# Altium project FL-0004 Power Rail Probe.PrjPcb (part 1 of 3)
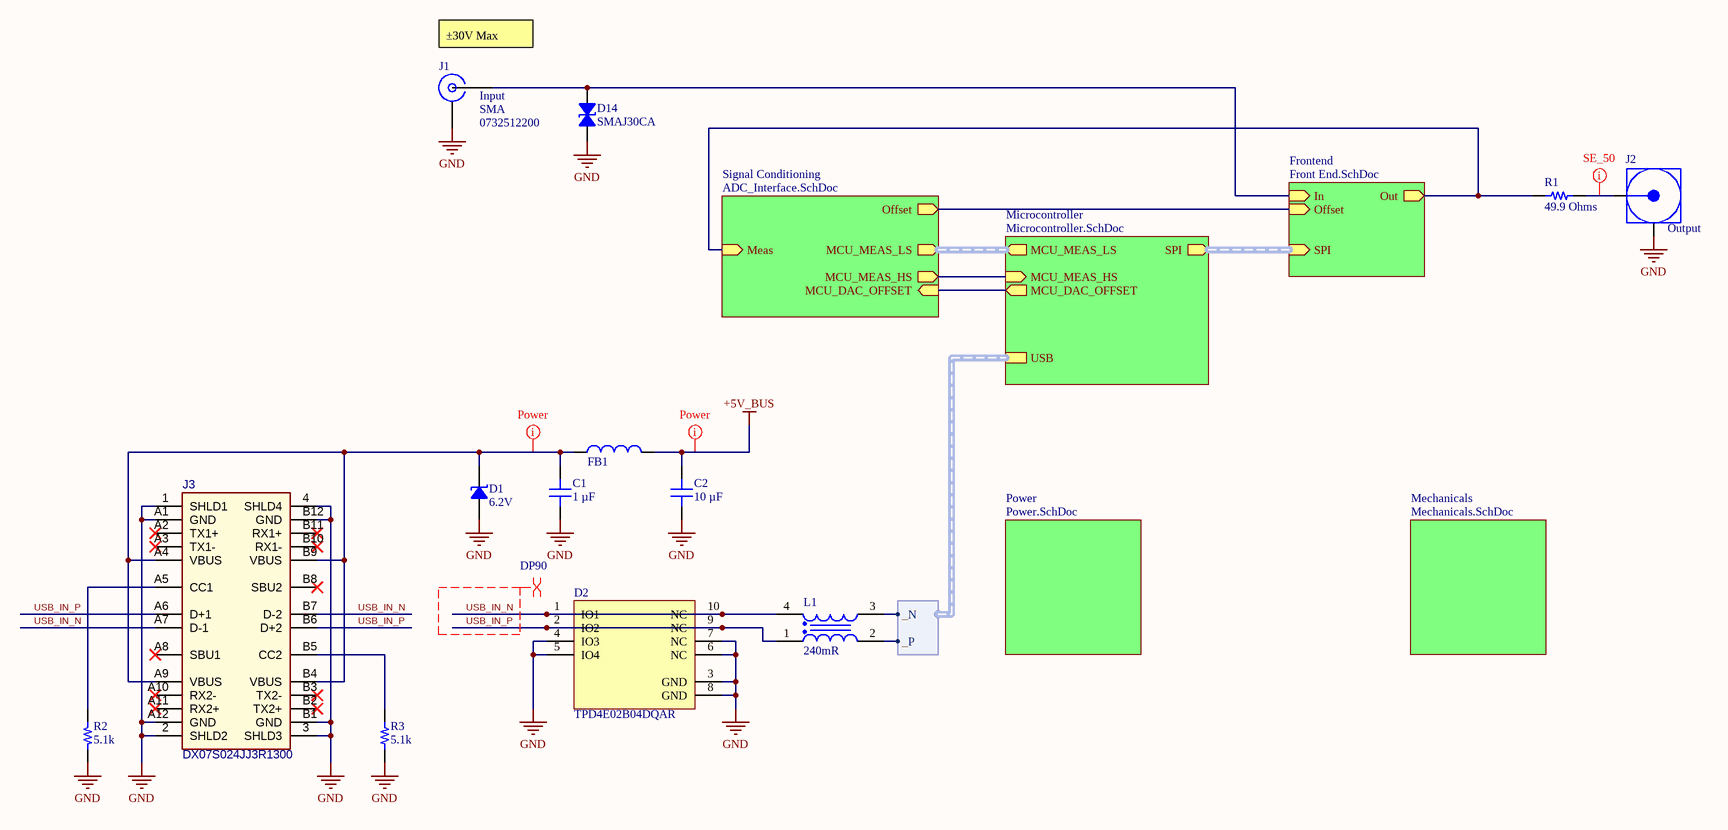
[diagram p0: Cover Sheet.SchDoc]
PRJ_Title: Power Rail Probe; PRJ_Number: FL-0004; PRJ_Engineer: Alexander Davis; PRJ_Customer: Public Release; PRJ_Copyright: ©2024 Flycatcher Labs - All Rights Reserved; PCB_Rev: A; Layout: Alex Davis; CurrentYear: 2024; BOM_Rev: 01; Address1: Flycatcher Labs
6 sheets, 200 parts. Net scope: hierarchical (ports join the sheet entries above them; power ports are global).
Board file: FL-0004.PCBDOC
Sheets:
  Cover Sheet.SchDoc
    Mechanicals = Mechanicals.SchDoc
    Frontend = Front End.SchDoc
    Microcontroller = Microcontroller.SchDoc
    Power = Power.SchDoc
    Signal Conditioning = ADC_Interface.SchDoc

## Sheet Cover Sheet.SchDoc: Cover Sheet
size Tabloid; SheetNumber: 1; SheetTotal: 6

### Parts
C1  1 µF  [CAP 0402_1005]
C2  10 µF  [CAP 0805_2012]
D1  Voltage - Breakdown (Min): 6.2V  [SOD323]  (hidden comment: D5V0S1U2WS-7)
D2  TPD4E02B04DQAR  [FP-DQA0010A-MFG]
D14  SMAJ30CA  [DO214AC SMA]
FB1  74279226101  [WE-MPSB_1812_L4.5W3.2H2.3]  (value not drawn)
J1  Input  Connector Style: SMA  Part Number: 0732512200  [MOLEX SD-73251-220 (NICKEL, 2.79MM FEET)]
J2  Output  [TE - 5227161-3]
J3  DX07S024JJ3R1300  [JAE-DX07S024JJ3_V]
L1  value 240mR  [WE-CNSW HF_0805]  (hidden comment: 744233670)
R1  49.9 Ohms  [RES 0805_2012]
R2  5.1k  [RES 0402_1005]
R3  5.1k  [RES 0402_1005]

### Sub-sheets
Frontend = Front End.SchDoc: SPI (in, harness SPI), Out (out), In (in), Offset (in)
Mechanicals = Mechanicals.SchDoc: no entries
Microcontroller = Microcontroller.SchDoc: SPI (out, harness SPI), MCU_DAC_OFFSET (out), MCU_MEAS_LS (out, harness DP), MCU_MEAS_HS (in), USB (harness DP)
Power = Power.SchDoc: no entries
Signal Conditioning = ADC_Interface.SchDoc: Meas (in), MCU_DAC_OFFSET (in), MCU_MEAS_LS (out, harness DP), MCU_MEAS_HS (out), Offset (out)

### Harnesses
DP: _P, _N

### Nets
+5V_BUS: C2.2 FB1.1
GND: C1.1 C2.1 D1.1 D2.3(GND) D2.4(IO3) D2.5(IO4) D2.6(NC) D2.7(NC) D2.8(GND) D14.1 J1.G(GND) J2.G(GND) J3.1(SHLD1) J3.2(SHLD2) J3.3(SHLD3) J3.4(SHLD4) J3.A1(GND) J3.A12(GND) J3.B1(GND) J3.B12(GND) R2.1 R3.1
MCU_DAC_Offset: sheet Microcontroller/MCU_DAC_OFFSET, sheet Signal Conditioning/MCU_DAC_OFFSET
MCU_MEAS_HS: sheet Microcontroller/MCU_MEAS_HS, sheet Signal Conditioning/MCU_MEAS_HS
MEAS_IN: D14.2 J1.S(SIGNAL) ; sheet Frontend/In
MEAS_OUT: R1.1 ; sheet Frontend/Out, sheet Signal Conditioning/Meas
OFFSET: sheet Frontend/Offset, sheet Signal Conditioning/Offset
USB._N: L1.3 ; sheet Microcontroller/USB._N
USB._P: L1.2 ; sheet Microcontroller/USB._P
USB_IN_N: D2.1(IO1) D2.10(NC) J3.A7(D-1) J3.B7(D-2) L1.4
USB_IN_P: D2.2(IO2) D2.9(NC) J3.A6(D+1) J3.B6(D+2) L1.1
NetC1_2: C1.2 D1.2 FB1.2 J3.A4(VBUS) J3.A9(VBUS) J3.B4(VBUS) J3.B9(VBUS)
NetJ2_S: J2.S(Signal) R1.2
NetJ3_A5: J3.A5(CC1) R2.2
NetJ3_B5: J3.B5(CC2) R3.2

Not connected (* = marked no-connect by the designer): J3 A2(TX1+)* A3(TX1-)* A8(SBU1)* A10(RX2-)* A11(RX2+)* B2(TX2+)* B3(TX2-)* B8(SBU2)* B10(RX1-)* B11(RX1+)*

### Buses and harness runs
harness sheet Frontend/SPI = sheet Microcontroller/SPI
harness sheet Microcontroller/MCU_MEAS_LS = sheet Signal Conditioning/MCU_MEAS_LS

### Layout directives
net class Power: +5V_BUS, NetC1_2
differential pair; differential pair class DP90: USB_IN_N, USB_IN_P
net class SE_50: NetJ2_S

### Notes on the sheet
- (near J1) ±30V Max

### Library data of the parts
C1 = CL05A105KO5NNNC: CAP CER 1UF 16V X5R 0402; manufacturer: Samsung Electro-Mechanics; Tolerance: ±10%; Part Number: CL05A105KO5NNNC; Value: 1 µF; Applications: General Purpose; Capacitance: 1 µF; componentlink1description: Datasheet; componentlink1url: http://www.samsungsem.com/kr/support/product-search/mlcc/CL05A105KO5NNNC.jsp; componentlink2description: DigiKey Link; componentlink2url: https://www.digikey.com/en/products/detail/samsung-electro-mechanics/CL05A105KO5NNNC/3886725; Device Package: 0402 (1005 Metric); lastupdated: 2/9/2024 8:04:35 PM; Lifecycle Status: Active; Minimum Order: 1; Mounting Type: Surface Mount, MLCC; Operating Temperature: -55°C ~ 85°C; Package / Case: 0402 (1005 Metric); packaging: TapeAndReel; partid: 3120; Part Status: Active; price: 0.01; series: CL; Size / Dimension: 0.039" L x 0.020" W (1.00mm x 0.50mm); Supplier 1: DigiKey; Supplier Part Number 1: 1276-1067-1-ND; Temperature Coefficient: X5R; Thickness (Max): 0.022" (0.55mm); Voltage - Rated: 16V
C2 = GCM21BC71E106KE36L: CAP CER 10UF 25V X7S 0805; manufacturer: Murata Electronics; Tolerance: ±10%; Part Number: GCM21BC71E106KE36L; Value: 10 µF; Applications: Automotive; Capacitance: 10 µF; componentlink1description: Datasheet; componentlink1url: https://search.murata.co.jp/Ceramy/image/img/A01X/G101/ENG/GCM21BC71E106KE36-01A.pdf; componentlink2description: DigiKey Link; componentlink2url: https://www.digikey.com/en/products/detail/murata-electronics/GCM21BC71E106KE36L/16821116; Device Package: 0805 (2012 Metric); lastupdated: 2/9/2024 8:14:44 PM; Lifecycle Status: Active; Minimum Order: 1; Mounting Type: Surface Mount, MLCC; Operating Temperature: -55°C ~ 125°C; Package / Case: 0805 (2012 Metric); packaging: TapeAndReel; partid: 48794; Part Status: Active; price: 0.09; Ratings: AEC-Q200; series: GCM; Size / Dimension: 0.079" L x 0.049" W (2.00mm x 1.25mm); Supplier 1: DigiKey; Supplier Part Number 1: 490-GCM21BC71E106KE36LCT-ND; Temperature Coefficient: X7S; Thickness (Max): 0.057" (1.45mm); Voltage - Rated: 25V
D1 = D5V0S1U2WS-7: TVS DIODE 5.5V 16V SOD323; Manufacturer: Diodes Incorporated; Capacitance @ Frequency: 950pF @ 1MHz; Current - Peak Pulse (10/1000µs): 70A (8/20µs); Power Line Protection: No; Power - Peak Pulse: 1000W (1kW); Type: Zener; Unidirectional Channels: 1; Voltage - Reverse Standoff (Typ): 5.5V (Max); Part Number: D5V0S1U2WS-7; Applications: Automotive; ComponentLink1Description: Datasheet; ComponentLink1URL: https://www.diodes.com/assets/Datasheets/D5V0S1U2WS.pdf; ComponentLink2Description: DigiKey Link; ComponentLink2URL: http://digikey.com/product-detail/en/diodes-incorporated/D5V0S1U2WS-7/31-D5V0S1U2WS-7CT-ND/11643340; LastUpdated: 8/30/2020 9:07:50 PM; Lifecycle Status: Active; Minimum Order: 1; Mounting Type: Surface Mount; Package / Case: SC-76, SOD-323; Packaging: CutTape; PartId: 11491; Price: 0.37; Series: Automotive, AEC-Q101; Supplier 1: DigiKey; Supplier Part Number 1: 31-D5V0S1U2WS-7CT-ND; Supplier Device Package: SOD-323; Voltage - Clamping (Max) @ Ipp: 16V
D2 = CMP-004-00031-2: Quad 0.25-pF, ±3.6-V, ±12-kV ESD protection diode for USB 3.0, HDMI 2.0 & High Speed Signals; Interface: USB,HDMI; Number of Bidirectional Channels: 4; Min Breakdown Voltage: 5.5V; Power Line Protection: No; Peak Pulse Power: 17W; Diode Type: ZENER; Peak Pulse Current: 5A; Breakdown Voltage: 6.4V; Direction: Bidirectional; Operating Supply Voltage: 3.6V; RoHS Compliant: Yes; Reach SVHC Compliant: No; Pins: 10; Number of Channels: 4; ComponentLink1URL: https://www.ti.com/lit/ds/symlink/tpd4e02b04.pdf; Packaging: Cut Tape; Mounting Technology: Surface Mount; Max Operating Temperature: 125°C; Width: 1mm; Thickness: 500um; Length: 2.5mm; Lead Free: Lead Free; ComponentLink1Description: Datasheet; Min Operating Temperature: -40°C; Series: -; Reverse Standoff Voltage: 3.6V; Height: 550um
D14 = SMAJ30CA: TVS DIODE 30VWM 48.4VC DO214AC; Manufacturer: Littelfuse Inc.; Bidirectional Channels: 1; Current - Peak Pulse (10/1000µs): 8.3A; Power Line Protection: No; Power - Peak Pulse: 400W; Type: Zener; Voltage - Breakdown (Min): 33.3V; Voltage - Clamping (Max) @ Ipp: 48.4V; Voltage - Reverse Standoff (Typ): 30V; Part Number: SMAJ30CA; Applications: General Purpose; ComponentLink1Description: Datasheet; ComponentLink1URL: https://www.littelfuse.com/~/media/electronics/datasheets/tvs_diodes/littelfuse_tvs_diode_smaj_datasheet.pdf.pdf; ComponentLink2Description: DigiKey Link; ComponentLink2URL: https://www.digikey.com/en/products/detail/littelfuse-inc/SMAJ30CA/762295; LastUpdated: 6/3/2024 8:21:17 PM; Lifecycle Status: Active; Minimum Order: 1; Mounting Type: Surface Mount; Operating Temperature: -65°C ~ 150°C (TJ); Package / Case: DO-214AC, SMA; Packaging: TapeAndReel; PartId: 7378; Part Status: Active; Price: 0.08; Series: SMAJ; Supplier 1: DigiKey; Supplier Part Number 1: SMAJ30CALFCT-ND; Supplier Device Package: DO-214AC (SMA)
FB1 = CMP-000000-2: Ferrite Beads Multi-Layer Power 100Ohm 25% 100MHz 8A 0.006Ohm DCR 1812 Automotive T/R; Impedance: 100R; Number of Lines: 1; Termination: SMD/SMT; Width: 3.2mm; Max Current Rating: 8A; Max DC Current: 8A; Package Quantity: 2500; ComponentLink1URL: https://www.we-online.com/components/products/datasheet/74279226101.pdf; Packaging: Cut Tape; Mounting Technology: Surface Mount; Max Operating Temperature: 125°C; Case/Package: 1812; Case Code (Imperial): 1812; RoHS Compliant: Yes; Test Frequency: 100MHz; Min Operating Temperature: -55°C; Lead Free: Lead Free; Tolerance: 25%; ComponentLink1Description: Datasheet; Series: WE-MPSB; Weight: 0.000952oz; Length: 4.5mm; Case Code (Metric): 4532; Height: 2.3mm
J1 = 0732512200: CONN SMA JACK R/A 50 OHM PCB; Manufacturer: Molex; Connector Type: Jack, Female Socket; Contact Termination: Solder; Frequency - Max: 18GHz; Impedance: 50Ohm; Number of Ports: 1; ComponentLink1Description: Datasheet; ComponentLink1URL: https://www.molex.com/pdm_docs/ps/PS-89675-346.pdf; ComponentLink2Description: DigiKey Link; ComponentLink2URL: http://digikey.com/product-detail/en/molex/0732512200/WM9352-ND/3468838; Fastening Type: Threaded; Housing Color: Silver; LastUpdated: 6/29/2022 6:13:17 PM; Lifecycle Status: Active; Minimum Order: 1; Mounting Feature: Bulkhead - Front Side Nut; Mounting Type: Panel Mount, Through Hole, Right Angle; Packaging: Bulk; Part Status: Active; Price: 5.75; Series: 73251; Shield Termination: Solder; Supplier 1: DigiKey; Supplier Part Number 1: WM9352-ND
J2 = CMP-002-00083-2: RF BNC Connector, 1 Contact(s), Female, Panel Mount, Solder Terminal, Locking, Jack; pin to pad: G>2 S>1; Sealable: No (Without); Number of Positions: 1; Voltage Rating: 500V; PCB Mounting Orientation: Right Angle; Operating Frequency: 0 to 4 GHz; Insulation Resistance: 5GR; Frequency: 4GHz; Body Material: Zinc; Dielectric Material: Polymethylpentene; PCB Mount Retention: With; Body Plating: Nickel; Impedance: 50R; Connector Type: BNC,Jack; Polarity: Standard,Normal; Packaging: Rail/Tube; Reach SVHC Compliant: No; Height: 15.88mm; Min Operating Temperature: -55°C; Mounting Technology: Panel; Orientation: Right Angle; Gender: Female; Fastening Type: Bayonet; ComponentLink1URL: https://www.te.com/commerce/DocumentDelivery/DDEController?Action=showdoc&DocId=Customer+Drawing%7F5227161%7FB4%7Fpdf%7FEnglish%7FENG_CD_5227161_B4.pdf%7F5227161-3; Radiation Hardening: No; Termination: Through Hole; Length: 14.76mm; Contact Plating: Gold; Package Quantity: 35; ComponentLink1Description: Datasheet; Max Operating Temperature: 85°C; Color: White; Housing Color: White; Insulation Material: Polymethylpentene; Contact Material: Bronze; Series: BNC; Clock Frequency: 4GHz; Depth: 14.76mm
J3 = CMP-002-00065-3: USB-C Connector, 20 V, 1.25 A, -30 to 80 degC, RoHS, Tape and Reel; Gender: Receptacle; Pins: 28; Connector Type: USB-C
L1 = CMP-006-00022-3: WE-CNSW HF SMT Common Mode Line Filter (High Frequ; Impedance: 67R; Current: 320mA; Number of Lines: 2; Operating Frequency: 10  1000MHz; Tolerance: 25%; Voltage Rating (AC): 50V; Test Frequency: 100MHz; Frequency: 6.5GHz; Lead Free: Lead Free; Packaging: Tape and Reel; RoHS Compliant: Yes; Max Operating Temperature: 105°C; Mounting Technology: Surface Mount; Width: 0.85mm; ComponentLink1Description: Datasheet; Reach SVHC Compliant: No; Case/Package: 0805; Max DC Current: 320mA; Pins: 4; Voltage Rating: 50V; ComponentLink1URL: https://www.we-online.com/components/products/datasheet/744233670.pdf; Min Operating Temperature: -40°C; Current Rating: 320mA; Depth: 1.2mm; DC Resistance (DCR): 240mR; Termination: SMD/SMT; Package Quantity: 1; Voltage Rating (DC): 50V; Length: 0.079inch; Max Current Rating: 320mA; Series: WE-CNSW; Height: 0.055inch
R1 = CRCW080549R9FKEAHP: RES SMD 49.9 OHM 1% 1/2W 0805; Manufacturer: Vishay Dale; Power (Watts): 0.5W, 1/2W; Temperature Coefficient: ±100ppm/°C; Part Number: CRCW080549R9FKEAHP; Value: 49.9 Ohms; ComponentLink1Description: Datasheet; ComponentLink1URL: http://www.vishay.com/docs/20043/crcwhpe3.pdf; ComponentLink2Description: DigiKey Link; ComponentLink2URL: https://www.digikey.com/en/products/detail/vishay-dale/CRCW080549R9FKEAHP/2222324; Composition: Thick Film; Device Package: 0805 (2012 Metric); Features: Automotive AEC-Q200, Pulse Withstanding; Height - Seated (Max): 0.020" (0.50mm); LastUpdated: 2/8/2024 9:02:28 PM; Lifecycle Status: Active; Minimum Order: 1; Number of Terminations: 2; Operating Temperature: -55°C ~ 155°C; Package / Case: 0805 (2012 Metric); Packaging: TapeAndReel; PartId: 30317; Part Status: Active; Price: 0.02; Ratings: AEC-Q200; Resistance: 49.9 Ohms; Series: CRCW-HP; Size / Dimension: 0.079" L x 0.049" W (2.00mm x 1.25mm); Supplier 1: DigiKey; Supplier Part Number 1: 541-49.9TCT-ND; Supplier Device Package: 0805; Tolerance: ±1%
R2 R3 = CRCW04025K10FKEDC: RES 5.1K OHM 1% 1/16W 0402; Manufacturer: Vishay Dale; Value: 5.1 kOhms; Power (Watts): 0.063W, 1/16W; Temperature Coefficient: ±100ppm/°C; Part Number: CRCW04025K10FKEDC; ComponentLink1Description: Datasheet; ComponentLink1URL: http://www.vishay.com/docs/28773/crcwce3.pdf; ComponentLink2Description: DigiKey Link; ComponentLink2URL: https://www.digikey.com/en/products/detail/vishay-dale/CRCW04025K10FKEDC/7928491; Composition: Thick Film; Device Package: 0402 (1005 Metric); Height - Seated (Max): 0.014" (0.35mm); LastUpdated: 2/9/2024 8:29:38 PM; Lifecycle Status: Active; Minimum Order: 1; Number of Terminations: 2; Operating Temperature: -55°C ~ 155°C; Package / Case: 0402 (1005 Metric); Packaging: CutTape; PartId: 16137; Part Status: Active; Price: 0.01; Resistance: 5.1 kOhms; Series: CRCW-C; Size / Dimension: 0.039" L x 0.020" W (1.00mm x 0.50mm); Supplier 1: DigiKey; Supplier Part Number 1: 541-4069-1-ND; Supplier Device Package: 0402; Tolerance: ±1%

## Sheet Mechanicals.SchDoc: Mechanicals
size Tabloid; SheetNumber: 6; SheetTotal: 6
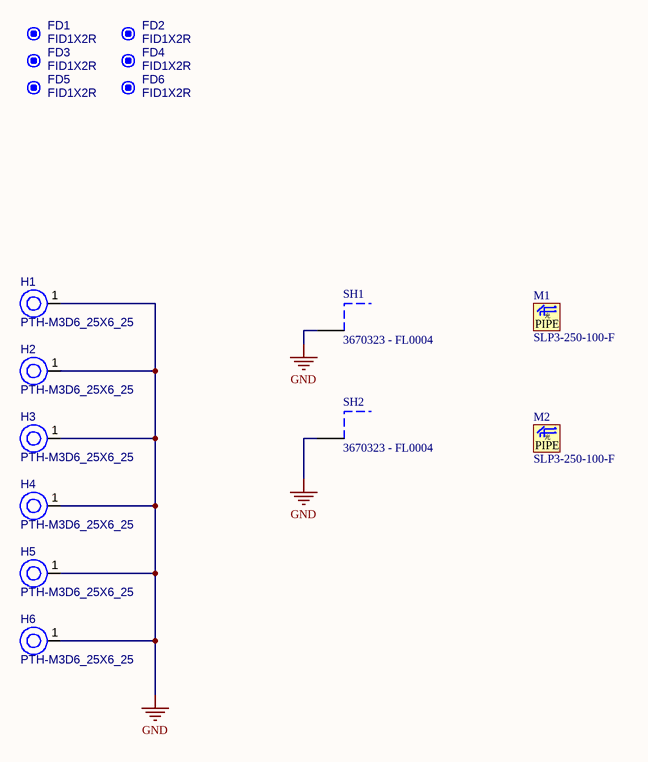
[diagram p1: Mechanicals.SchDoc]

### Parts
FD1  FID1X2R  [FID1X2R]  (no BOM)
FD2  FID1X2R  [FID1X2R]  (no BOM)
FD3  FID1X2R  [FID1X2R]  (no BOM)
FD4  FID1X2R  [FID1X2R]  (no BOM)
FD5  FID1X2R  [FID1X2R]  (no BOM)
FD6  FID1X2R  [FID1X2R]  (no BOM)
H1  PTH-M3D6_25X6_25  [PTH-M3D6_25X6_25]  (no BOM)
H2  PTH-M3D6_25X6_25  [PTH-M3D6_25X6_25]  (no BOM)
H3  PTH-M3D6_25X6_25  [PTH-M3D6_25X6_25]  (no BOM)
H4  PTH-M3D6_25X6_25  [PTH-M3D6_25X6_25]  (no BOM)
H5  PTH-M3D6_25X6_25  [PTH-M3D6_25X6_25]  (no BOM)
H6  PTH-M3D6_25X6_25  [PTH-M3D6_25X6_25]  (no BOM)
M1  SLP3-250-100-F  [BIVAR SLP3-250-100-F]
M2  SLP3-250-100-F  [BIVAR SLP3-250-100-F]
SH1  3670323 - FL0004  [3670323 - FL-0004]
SH2  3670323 - FL0004  [3670323 - FL-0004]

### Nets
GND: H1.1(H1) H2.1(H1) H3.1(H1) H4.1(H1) H5.1(H1) H6.1(H1) SH1.1 SH2.1

### Notes on the sheet
- (in symbol SLP3-250-100-F) 光; PIPE

### Library data of the parts
FD1-FD6 = CMP-00028-00005-3: Fiducial - Round 1x2mm; Pins: 0
H1-H6 = CMP-00028-00007-2: M3 PTH (3mm), 6.25mm pad; Pins: 1
M1 M2 = SLP3-250-100-F: LIGHT PIPE CLEAR 3MM LENS R/A; Manufacturer: Bivar Inc.; Configuration: Single; Lens Style: Round with Flat Top; Part Number: SLP3-250-100-F; Color: Clear; ComponentLink1Description: Datasheet; ComponentLink1URL: https://www.bivar.com/Files/Datasheets/SLP3-XXX-XXX-X.pdf; ComponentLink2Description: DigiKey Link; ComponentLink2URL: http://digikey.com/product-detail/en/bivar-inc/SLP3-250-100-F/492-1311-ND/2407221; LastUpdated: 3/20/2020 5:05:34 AM; Lens Size: 3mm; Lifecycle Status: Active; Minimum Order: 1; Mounting Type: Board Mount, Press Fit, Right Angle; Packaging: Unknown; Part Status: Active; Price: 0.59; Series: SLP-3; Supplier 1: DigiKey; Supplier Part Number 1: 492-1311-ND; Type: Rigid
SH1 SH2 = CMP-00025-00005-3: Shield Cabinet Frame, 32.3mm X 23.8mm Wurth Elektronik 3670323 - modified footprint for FL-0004

## Sheet Front End.SchDoc: Front End
size Tabloid; Organization: Davis Designs; Address1: Flycatcher Labs; SheetNumber: 2; SheetTotal: 6
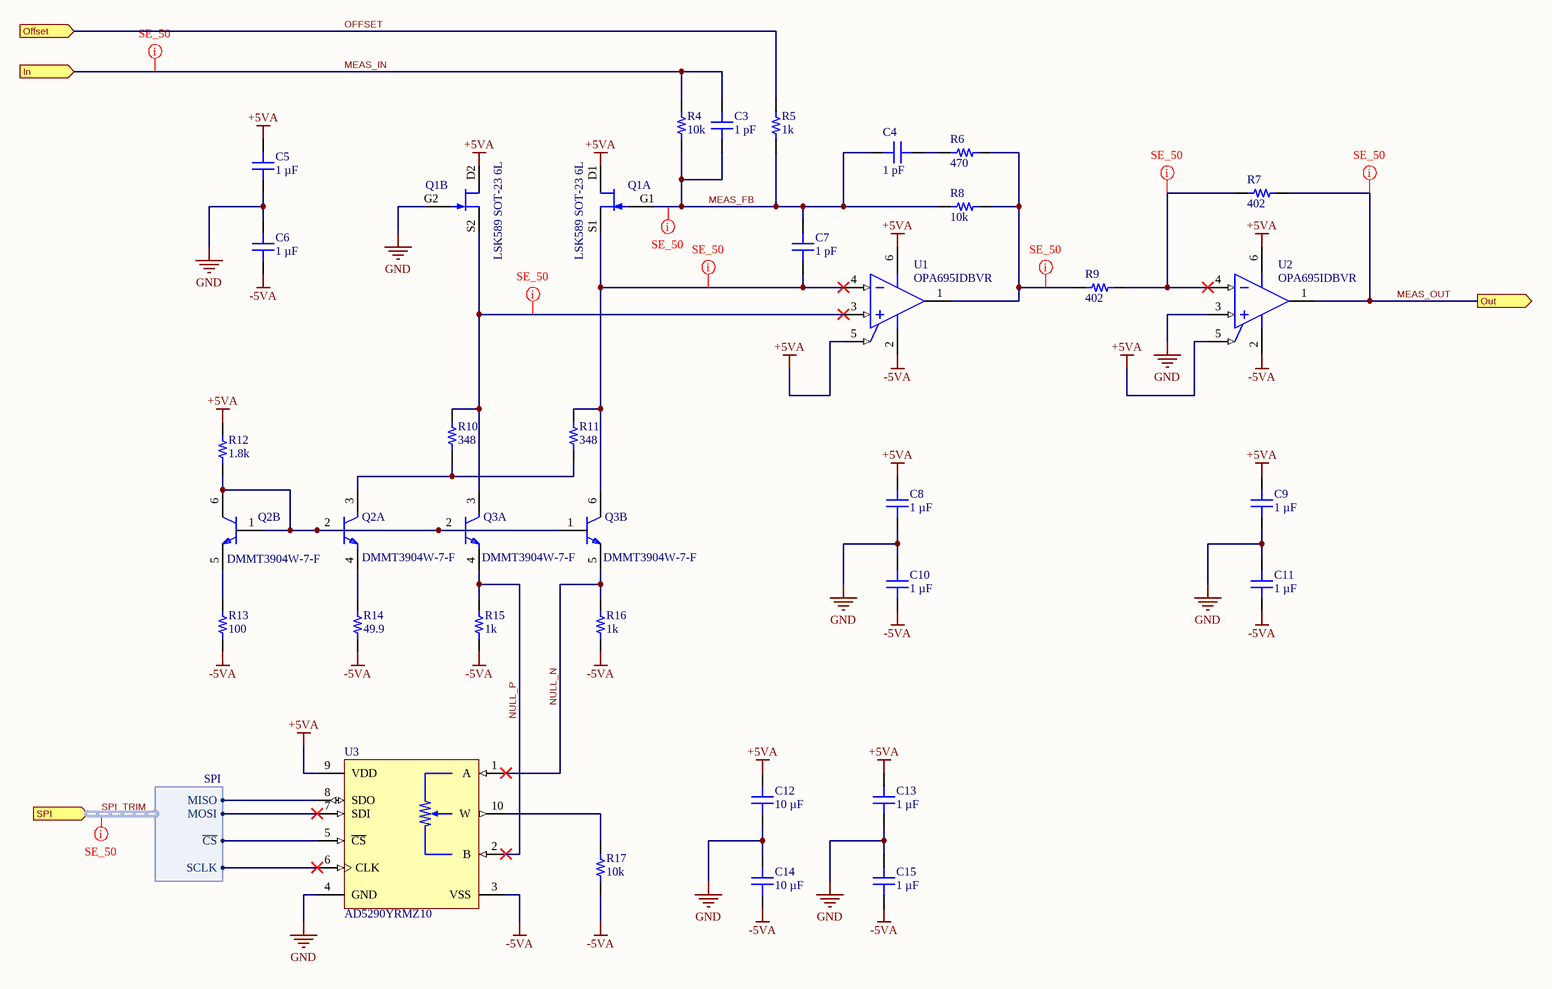
[diagram p2: Front End.SchDoc]

### Parts
C3  1 pF  [MURATA GCM155 0402_1005]
C4  1 pF  [MURATA GCM155 0402_1005]
C5  1 µF  [MURATA GRM155 0402_1005]
C6  1 µF  [MURATA GRM155 0402_1005]
C7  1 pF  [MURATA GCM155 0402_1005]
C8  1 µF  [MURATA GRM155 0402_1005]
C9  1 µF  [MURATA GRM155 0402_1005]
C10  1 µF  [MURATA GRM155 0402_1005]
C11  1 µF  [MURATA GRM155 0402_1005]
C12  10 µF  [CAP 0805_2012]
C13  1 µF  [MURATA GRM155 0402_1005]
C14  10 µF  [CAP 0805_2012]
C15  1 µF  [MURATA GRM155 0402_1005]
Q1  LSK589 SOT-23 6L  [SOT95P280X145-6N]  (parts A,B of 2)
Q2  DMMT3904W-7-F  [FP-SOT363-MFG]  (parts A,B of 2)
Q3  DMMT3904W-7-F  [FP-SOT363-MFG]  (parts A,B of 2)
R4  10k  [RES 0402_1005]
R5  1k  [RES 0402_1005]
R6  470  [RES 0402_1005]
R7  402  [RES 0402_1005]
R8  10k  [RES 0402_1005]
R9  402  [RES 0402_1005]
R10  348  [RES 0402_1005]
R11  348  [RES 0402_1005]
R12  1.8k  [RES 0402_1005]
R13  100  [RES 0402_1005]
R14  49.9  [RES 0402_1005]
R15  1k  [RES 0402_1005]
R16  1k  [RES 0402_1005]
R17  10k  [RES 0402_1005]
U1  OPA695IDBVR  [DBV0006A_M]
U2  OPA695IDBVR  [DBV0006A_M]
U3  AD5290YRMZ10  [FP-RM-10-IPC_B]

### Ports
In (in), Offset (in), Out (out), SPI (in, harness SPI)

### Harnesses
SPI: MOSI, MISO, ~{CS}, SCLK

### Nets
+5VA: C5.2 C8.2 C9.2 C12.2 C13.2 Q1.D1 Q1.D2 R12.2 U1.5(~{DIS}) U1.6(VS+) U2.5(~{DIS}) U2.6(VS+) U3.9(VDD)
-5VA: C6.1 C10.1 C11.1 C14.1 C15.1 R13.1 R14.1 R15.1 R16.1 R17.1 U1.2(VS-) U2.2(VS-) U3.3(VSS)
GND: C5.1 C6.2 C8.1 C9.1 C10.2 C11.2 C12.1 C13.1 C14.2 C15.2 Q1.G2 U2.3(IN+) U3.4(GND)
MEAS_FB: C3.1 C4.2 C7.2 Q1.G1 R4.1 R5.2 R8.2
MEAS_IN: C3.2 R4.2 ; port In
MEAS_OUT: R7.2 U2.1(OUT) ; port Out
NULL_N: Q3.5(E2) R16.2 U3.1(A)
NULL_P: Q3.4(E1) R15.2 U3.2(B)
OFFSET: R5.1 ; port Offset
SPI_TRIM~{.}CS: U3.5(~{CS}) ; port SPI.~{CS}
SPI_TRIM.MISO: U3.8(SDO) ; port SPI.MISO
SPI_TRIM.MOSI: U3.7(SDI) ; port SPI.MOSI
SPI_TRIM.SCLK: U3.6(CLK) ; port SPI.SCLK
NetC4_1: C4.1 R6.1
NetC7_1: C7.1 Q1.S1 Q3.6(C2) R11.2 U1.4(IN-)
NetQ1_S2: Q1.S2 Q3.3(C1) R10.2 U1.3(IN+)
NetQ2_1: Q2.1(B2) Q2.2(B1) Q2.6(C2) Q3.1(B2) Q3.2(B1) R12.1
NetQ2_3: Q2.3(C1) R10.1 R11.1
NetQ2_4: Q2.4(E1) R14.2
NetQ2_5: Q2.5(E2) R13.2
NetR6_2: R6.2 R8.1 R9.1 U1.1(OUT)
NetR7_1: R7.1 R9.2 U2.4(IN-)
NetR17_2: R17.2 U3.10(W)

### Buses and harness runs
harness SPI_TRIM = port SPI

### Layout directives
net class SE_50: (no net found under the mark), MEAS_FB, MEAS_IN, MEAS_OUT, NetC7_1, NetQ1_S2, NetR6_2, NetR7_1

### Library data of the parts
C3 C4 C7 = GCM1555C1H1R0BA16D: CAP CER 1PF 50V C0G/NP0 0402; manufacturer: Murata Electronics; Temperature Coefficient: C0G, NP0; Tolerance: ±0.1pF; Part Number: GCM1555C1H1R0BA16D; Value: 1 pF; Applications: Automotive; Capacitance: 1 pF; componentlink1description: Datasheet; componentlink1url: https://search.murata.co.jp/Ceramy/image/img/A01X/G101/ENG/GCM1555C1H1R0BA16-01.pdf; componentlink2description: DigiKey Link; componentlink2url: https://www.digikey.com/en/products/detail/murata-electronics/GCM1555C1H1R0BA16D/7363198; Device Package: 0402 (1005 Metric); lastupdated: 7/20/2024 2:04:19 AM; Lifecycle Status: Active; Minimum Order: 1; Mounting Type: Surface Mount, MLCC; Operating Temperature: -55°C ~ 125°C; Package / Case: 0402 (1005 Metric); packaging: TapeAndReel; partid: 2073; Part Status: Active; price: 0.01; Ratings: AEC-Q200; series: GCM; Size / Dimension: 0.039" L x 0.020" W (1.00mm x 0.50mm); Supplier 1: DigiKey; Supplier Part Number 1: 490-16454-1-ND; Thickness (Max): 0.022" (0.55mm); Voltage - Rated: 50V
C5 C6 C8-C11 C13 C15 = GRM155R61E105MA12D: CAP CER 1UF 25V X5R 0402; manufacturer: Murata Electronics; Tolerance: ±20%; Part Number: GRM155R61E105MA12D; Value: 1 µF; Applications: General Purpose; Capacitance: 1 µF; componentlink1description: Datasheet; componentlink1url: https://search.murata.co.jp/Ceramy/image/img/A01X/G101/ENG/GRM155R61E105MA12-01.pdf; componentlink2description: DigiKey Link; componentlink2url: https://www.digikey.com/en/products/detail/murata-electronics/GRM155R61E105MA12D/4905141; Device Package: 0402 (1005 Metric); lastupdated: 7/25/2024 4:50:24 AM; Lifecycle Status: Active; Minimum Order: 1; Mounting Type: Surface Mount, MLCC; Operating Temperature: -55°C ~ 85°C; Package / Case: 0402 (1005 Metric); packaging: TapeAndReel; partid: 3014; Part Status: Active; price: 0.01; series: GRM; Size / Dimension: 0.039" L x 0.020" W (1.00mm x 0.50mm); Supplier 1: DigiKey; Supplier Part Number 1: 490-10018-1-ND; Temperature Coefficient: X5R; Thickness (Max): 0.022" (0.55mm); Voltage - Rated: 25V
C12 C14 = GCM21BC71E106KE36L: as C2 on sheet Cover Sheet; Part Number: GCM21BC71E106KE36L; Value: 10 µF; Applications: Automotive; Capacitance: 10 µF; componentlink1description: Datasheet; componentlink1url: https://search.murata.co.jp/Ceramy/image/img/A01X/G101/ENG/GCM21BC71E106KE36-01A.pdf; componentlink2description: DigiKey Link; componentlink2url: https://www.digikey.com/en/products/detail/murata-electronics/GCM21BC71E106KE36L/16821116; Device Package: 0805 (2012 Metric); lastupdated: 2/9/2024 8:14:44 PM; Lifecycle Status: Active; Minimum Order: 1; Mounting Type: Surface Mount, MLCC; Operating Temperature: -55°C ~ 125°C; Package / Case: 0805 (2012 Metric); packaging: TapeAndReel; partid: 48794; Part Status: Active; price: 0.09; Ratings: AEC-Q200; series: GCM; Size / Dimension: 0.079" L x 0.049" W (2.00mm x 1.25mm); Supplier 1: DigiKey; Supplier Part Number 1: 490-GCM21BC71E106KE36LCT-ND; Temperature Coefficient: X7S; Thickness (Max): 0.057" (1.45mm); Voltage - Rated: 25V
Q1 = CMP-013-00039-2: Low Noise, Monolithic Dual, N-Channel JFET; pin to pad: D1>2 D2>5 G1>1 G2>4 S1>3 S2>6; Temperature (min): -55; Vgs Off: 1.5V; Vgs Max: 25V; Input Capacitance: 5pF; Temperature (max): 150; Ids Max: 7mA; Transistor Type: JFET N-Channel Dual; ComponentLink1URL: https://www.linearsystems.com/_files/ugd/7e8069_bae9694bd1b545959f18563741a7b804.pdf; Package: SOT-23-6; ComponentLink1Description: Datasheet
Q2 Q3 = CMP-013-00040-2: TRANS 2NPN 40V 0.2A SOT363; Polarity: NPN; Emitter Base Voltage (VEBO): 6V; Continuous Collector Current: 200mA; Collector-emitter Voltage-Max: 300mV; Frequency: 300MHz; Collector Base Voltage (VCBO): 60V; hFE Min: 100; Max Power Dissipation: 200mW; Number of Elements: 2; Width: 1.35mm; Voltage Rating (DC): 40V; Height: 1mm; Case/Package: SOT-363; Length: 2.2mm; Max Operating Temperature: 150°C; Max Breakdown Voltage: 40V; Collector Emitter Voltage (VCEO): 40V; Lead Free: Lead Free; Current Rating: 200mA; Weight: 0.000212oz; Clock Frequency: 300MHz; Reach SVHC Compliant: Yes; Package Quantity: 3000; Packaging: Tape and Reel; Collector Emitter Breakdown Voltage: 40V; Transition Frequency: 300MHz; Min Operating Temperature: -55°C; Mounting Technology: Surface Mount; Radiation Hardening: No; Series: -; Max Collector Current: 200mA; Gain Bandwidth Product: 300MHz; Pins: 6; Power Dissipation: 200mW; Collector Emitter Saturation Voltage: 300mV; ComponentLink1Description: Datasheet; ComponentLink1URL: https://www.diodes.com/assets/Datasheets/DMMT3904W.pdf
R4 R8 R17 = ERA-2VRW1002X: RES 10K OHM 0.05% 1/10W 0402; Manufacturer: Panasonic Electronic Components; Value: 10 kOhms; Power (Watts): 0.1W, 1/10W; Temperature Coefficient: ±10ppm/°C; Part Number: ERA-2VRW1002X; ComponentLink1Description: Datasheet; ComponentLink1URL: https://api.pim.na.industrial.panasonic.com/file_stream/main/fileversion/9152; ComponentLink2Description: DigiKey Link; ComponentLink2URL: https://www.digikey.com/en/products/detail/panasonic-electronic-components/ERA-2VRW1002X/12085128; Composition: Thin Film; Device Package: 0402 (1005 Metric); Height - Seated (Max): 0.016" (0.40mm); LastUpdated: 2/9/2024 8:28:44 PM; Lifecycle Status: Active; Minimum Order: 1; Number of Terminations: 2; Operating Temperature: -55°C ~ 155°C; Package / Case: 0402 (1005 Metric); Packaging: TapeAndReel; PartId: 70282; Part Status: Active; Price: 0.21; Resistance: 10 kOhms; Series: ERA-2V; Size / Dimension: 0.039" L x 0.020" W (1.00mm x 0.50mm); Supplier 1: DigiKey; Supplier Part Number 1: 10-ERA-2VRW1002XCT-ND; Supplier Device Package: 0402; Tolerance: ±0.05%; Features: Anti-Sulfur, Automotive AEC-Q200; Ratings: AEC-Q200
R5 R15 R16 = ERA-2AEB102X: RES SMD 1K OHM 0.1% 1/16W 0402; Manufacturer: Panasonic Electronic Components; Value: 1 kOhms; Power (Watts): 0.063W, 1/16W; Temperature Coefficient: ±25ppm/°C; Part Number: ERA-2AEB102X; ComponentLink1Description: Datasheet; ComponentLink1URL: https://industrial.panasonic.com/cdbs/www-data/pdf/RDM0000/AOA0000C307.pdf; ComponentLink2Description: DigiKey Link; ComponentLink2URL: https://www.digikey.com/en/products/detail/panasonic-electronic-components/ERA-2AEB102X/1706005; Composition: Thin Film; Device Package: 0402 (1005 Metric); Features: Automotive AEC-Q200; Height - Seated (Max): 0.016" (0.40mm); LastUpdated: 2/9/2024 8:30:08 PM; Lifecycle Status: Active; Minimum Order: 1; Number of Terminations: 2; Operating Temperature: -55°C ~ 155°C; Package / Case: 0402 (1005 Metric); Packaging: TapeAndReel; PartId: 6077; Part Status: Active; Price: 0.04; Ratings: AEC-Q200; Resistance: 1 kOhms; Series: ERA-2A; Size / Dimension: 0.039" L x 0.020" W (1.00mm x 0.50mm); Supplier 1: DigiKey; Supplier Part Number 1: P1.0KDCCT-ND; Supplier Device Package: 0402; Tolerance: ±0.1%
R6 = CRCW0402470RFKEDC: RES 470 OHM 1% 1/16W 0402; Manufacturer: Vishay Dale; Value: 470 Ohms; Power (Watts): 0.063W, 1/16W; Temperature Coefficient: ±100ppm/°C; Part Number: CRCW0402470RFKEDC; ComponentLink1Description: Datasheet; ComponentLink1URL: http://www.vishay.com/docs/28773/crcwce3.pdf; ComponentLink2Description: DigiKey Link; ComponentLink2URL: https://www.digikey.com/en/products/detail/vishay-dale/CRCW0402470RFKEDC/7928494; Composition: Thick Film; Device Package: 0402 (1005 Metric); Height - Seated (Max): 0.014" (0.35mm); LastUpdated: 2/9/2024 8:29:48 PM; Lifecycle Status: Active; Minimum Order: 1; Number of Terminations: 2; Operating Temperature: -55°C ~ 155°C; Package / Case: 0402 (1005 Metric); Packaging: CutTape; PartId: 12711; Part Status: Active; Price: 0.01; Resistance: 470 Ohms; Series: CRCW-C; Size / Dimension: 0.039" L x 0.020" W (1.00mm x 0.50mm); Supplier 1: DigiKey; Supplier Part Number 1: 541-4072-1-ND; Supplier Device Package: 0402; Tolerance: ±1%
R7 R9 = ERA-2AEB4020X: RES SMD 402 OHM 0.1% 1/16W 0402; Manufacturer: Panasonic Electronic Components; Value: 402 Ohms; Power (Watts): 0.063W, 1/16W; Temperature Coefficient: ±25ppm/°C; Part Number: ERA-2AEB4020X; ComponentLink1Description: Datasheet; ComponentLink1URL: https://industrial.panasonic.com/cdbs/www-data/pdf/RDM0000/AOA0000C307.pdf; ComponentLink2Description: DigiKey Link; ComponentLink2URL: https://www.digikey.com/en/products/detail/panasonic-electronic-components/ERA-2AEB4020X/2026017; Composition: Thin Film; Device Package: 0402 (1005 Metric); Features: Automotive AEC-Q200; Height - Seated (Max): 0.016" (0.40mm); LastUpdated: 2/9/2024 8:29:56 PM; Lifecycle Status: Active; Minimum Order: 1; Number of Terminations: 2; Operating Temperature: -55°C ~ 155°C; Package / Case: 0402 (1005 Metric); Packaging: TapeAndReel; PartId: 9913; Part Status: Active; Price: 0.04; Ratings: AEC-Q200; Resistance: 402 Ohms; Series: ERA-2A; Size / Dimension: 0.039" L x 0.020" W (1.00mm x 0.50mm); Supplier 1: DigiKey; Supplier Part Number 1: P402DCCT-ND; Supplier Device Package: 0402; Tolerance: ±0.1%
R10 R11 = CRCW0402348RFKED: RES SMD 348 OHM 1% 1/16W 0402; Manufacturer: Vishay Dale; Value: 348 Ohms; Power (Watts): 0.063W, 1/16W; Temperature Coefficient: ±100ppm/°C; Part Number: CRCW0402348RFKED; ComponentLink1Description: Datasheet; ComponentLink1URL: http://www.vishay.com/docs/20035/dcrcwe3.pdf; ComponentLink2Description: DigiKey Link; ComponentLink2URL: https://www.digikey.com/en/products/detail/vishay-dale/CRCW0402348RFKED/1177953; Composition: Thick Film; Device Package: 0402 (1005 Metric); Features: Automotive AEC-Q200; Height - Seated (Max): 0.016" (0.40mm); LastUpdated: 2/9/2024 8:29:58 PM; Lifecycle Status: Active; Minimum Order: 1; Number of Terminations: 2; Operating Temperature: -55°C ~ 155°C; Package / Case: 0402 (1005 Metric); Packaging: TapeAndReel; PartId: 9380; Part Status: Active; Price: 0.01; Ratings: AEC-Q200; Resistance: 348 Ohms; Series: CRCW; Size / Dimension: 0.039" L x 0.020" W (1.00mm x 0.50mm); Supplier 1: DigiKey; Supplier Part Number 1: 541-348LCT-ND; Supplier Device Package: 0402; Tolerance: ±1%
R12 = CRCW04021K80FKED: RES SMD 1.8K OHM 1% 1/16W 0402; Manufacturer: Vishay Dale; Value: 1.8 kOhms; Power (Watts): 0.063W, 1/16W; Temperature Coefficient: ±100ppm/°C; Part Number: CRCW04021K80FKED; ComponentLink1Description: Datasheet; ComponentLink1URL: http://www.vishay.com/docs/20035/dcrcwe3.pdf; ComponentLink2Description: DigiKey Link; ComponentLink2URL: https://www.digikey.com/en/products/detail/vishay-dale/CRCW04021K80FKED/1178034; Composition: Thick Film; Device Package: 0402 (1005 Metric); Features: Automotive AEC-Q200; Height - Seated (Max): 0.016" (0.40mm); LastUpdated: 2/9/2024 8:29:55 PM; Lifecycle Status: Active; Minimum Order: 1; Number of Terminations: 2; Operating Temperature: -55°C ~ 155°C; Package / Case: 0402 (1005 Metric); Packaging: TapeAndReel; PartId: 10328; Part Status: Active; Price: 0.01; Ratings: AEC-Q200; Resistance: 1.8 kOhms; Series: CRCW; Size / Dimension: 0.039" L x 0.020" W (1.00mm x 0.50mm); Supplier 1: DigiKey; Supplier Part Number 1: 541-1.80KLCT-ND; Supplier Device Package: 0402; Tolerance: ±1%
R13 = CRCW0402100RFKEE: RES SMD 100 OHM 1% 1/16W 0402; Manufacturer: Vishay Dale; Value: 100 Ohms; Power (Watts): 0.063W, 1/16W; Temperature Coefficient: ±100ppm/°C; Part Number: CRCW0402100RFKEE; ComponentLink1Description: Datasheet; ComponentLink1URL: http://www.vishay.com/docs/20035/dcrcwe3.pdf; ComponentLink2Description: DigiKey Link; ComponentLink2URL: https://www.digikey.com/en/products/detail/vishay-dale/CRCW0402100RFKEE/5069886; Composition: Thick Film; Device Package: 0402 (1005 Metric); Features: Automotive AEC-Q200; Height - Seated (Max): 0.016" (0.40mm); LastUpdated: 2/9/2024 8:30:05 PM; Lifecycle Status: Active; Minimum Order: 1; Number of Terminations: 2; Operating Temperature: -55°C ~ 155°C; Package / Case: 0402 (1005 Metric); Packaging: CutTape; PartId: 6830; Part Status: Active; Price: 0.01; Ratings: AEC-Q200; Resistance: 100 Ohms; Series: CRCW; Size / Dimension: 0.039" L x 0.020" W (1.00mm x 0.50mm); Supplier 1: DigiKey; Supplier Part Number 1: 541-2953-1-ND; Supplier Device Package: 0402; Tolerance: ±1%
R14 = ERA-2AEB49R9X: RES SMD 49.9 OHM 0.1% 1/16W 0402; Manufacturer: Panasonic Electronic Components; Value: 49.9 Ohms; Power (Watts): 0.063W, 1/16W; Temperature Coefficient: ±25ppm/°C; Part Number: ERA-2AEB49R9X; ComponentLink1Description: Datasheet; ComponentLink1URL: https://industrial.panasonic.com/cdbs/www-data/pdf/RDM0000/AOA0000C307.pdf; ComponentLink2Description: DigiKey Link; ComponentLink2URL: https://www.digikey.com/en/products/detail/panasonic-electronic-components/ERA-2AEB49R9X/2025936; Composition: Thin Film; Device Package: 0402 (1005 Metric); Features: Automotive AEC-Q200; Height - Seated (Max): 0.016" (0.40mm); LastUpdated: 2/9/2024 8:30:08 PM; Lifecycle Status: Active; Minimum Order: 1; Number of Terminations: 2; Operating Temperature: -55°C ~ 155°C; Package / Case: 0402 (1005 Metric); Packaging: TapeAndReel; PartId: 6106; Part Status: Active; Price: 0.04; Ratings: AEC-Q200; Resistance: 49.9 Ohms; Series: ERA-2A; Size / Dimension: 0.039" L x 0.020" W (1.00mm x 0.50mm); Supplier 1: DigiKey; Supplier Part Number 1: P49.9DCCT-ND; Supplier Device Package: 0402; Tolerance: ±0.1%
U1 U2 = CMP-014-00009-2: Ultra-Wideband, Current-Feedback Operational Amplifier with Disable 6-SOT-23 -40 to 85; Power Supply Rejection Ratio (PSRR): 56dB; Number of Elements: 1; Input Bias Current: 41uA; -3db Bandwidth: 1.7GHz; Max I/O Voltage: 3mV; Slew Rate: 2900V/µs; Supply Current: 13.3mA; Max Dual Supply Voltage: 6V; Output Current per Channel: 120mA; Settling Time: 10ns; Min Supply Voltage: 5V; Operating Supply Current: 12.9mA; Min Dual Supply Voltage: 2.5V; Common Mode Rejection Ratio: 51dB; Max Supply Voltage: 12V; Pins: 6; Radiation Hardening: No; Lead Free: Lead Free; Packaging: Tape and Reel; Number of Amplifiers: 1; Package Quantity: 3000; Max Operating Temperature: 85°C; RoHS Compliant: Yes; Case/Package: SOT-23-6; ComponentLink1URL: https://www.ti.com/lit/ds/symlink/opa695.pdf; Number of Channels: 1; Bandwidth: 1.7GHz; Number of Circuits: 1; Reach SVHC Compliant: No; Series: -; Gain Bandwidth Product: 1.7GHz; ComponentLink1Description: Datasheet; Min Operating Temperature: -40°C; Input Offset Voltage (Vos): 3mV
U3 = CMP-015-00014-2: Digital Potentiometer 10kOhm 256POS Volatile Automotive 10-Pin MSOP T/R; Number of Elements: 1; Temperature Coefficient: 35ppm/°C; -3db Bandwidth: 470kHz; Supply Current: 15uA; Frequency: 4MHz; Max Dual Supply Voltage: 15V; Min Dual Supply Voltage: 10V; Number of Positions: 256; Interface: SPI; Max Supply Voltage: 30V; Value: 10kR; Min Supply Voltage: 20V; Tolerance: 30%; RoHS Compliant: Yes; Case/Package: MSOP; Number of Circuits: 1; Min Operating Temperature: -40°C; Taper: Linear; Package Quantity: 50; Packaging: Rail/Tube; Mounting Technology: Surface Mount; Series: -; Max Operating Temperature: 125°C; Memory Format: Volatile; Number of Taps: 256; Max Supply Current: 15uA; Pins: 10; Operating Supply Current: 15uA; Contact Plating: Tin,Matte; ComponentLink1Description: Datasheet; ComponentLink1URL: https://www.analog.com/media/en/technical-documentation/data-sheets/AD5290.pdf